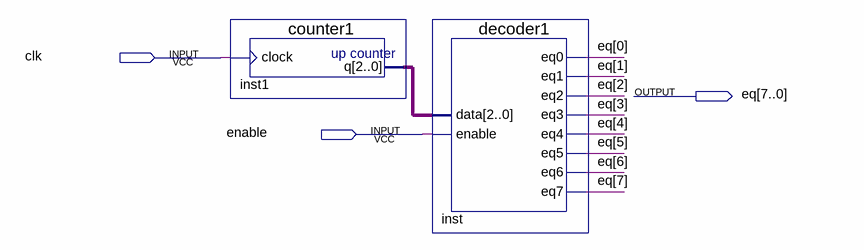
[diagram p0: schematic sheet]
// Quartus schematic b1.bdf as structural Verilog: 2 symbols, 3 pins
module b1 (
  input  clk,
  input  enable,
  output [7:0] eq
);

  wire [2:0] inst1_q;

  counter1 inst1 (.clock(clk), .q(inst1_q));
  decoder1 inst (
    .data(inst1_q), .enable(enable), .eq0(eq[0]), .eq1(eq[1]), .eq2(eq[2]), .eq3(eq[3]), .eq4(eq[4]),
    .eq5(eq[5]), .eq6(eq[6]), .eq7(eq[7]));
endmodule
